# Altium schematic sheet CY8C4125AZI-S433.SchDoc: CY8C4125AZI-S433
size A3; SheetNumber: 2; SheetTotal: 3
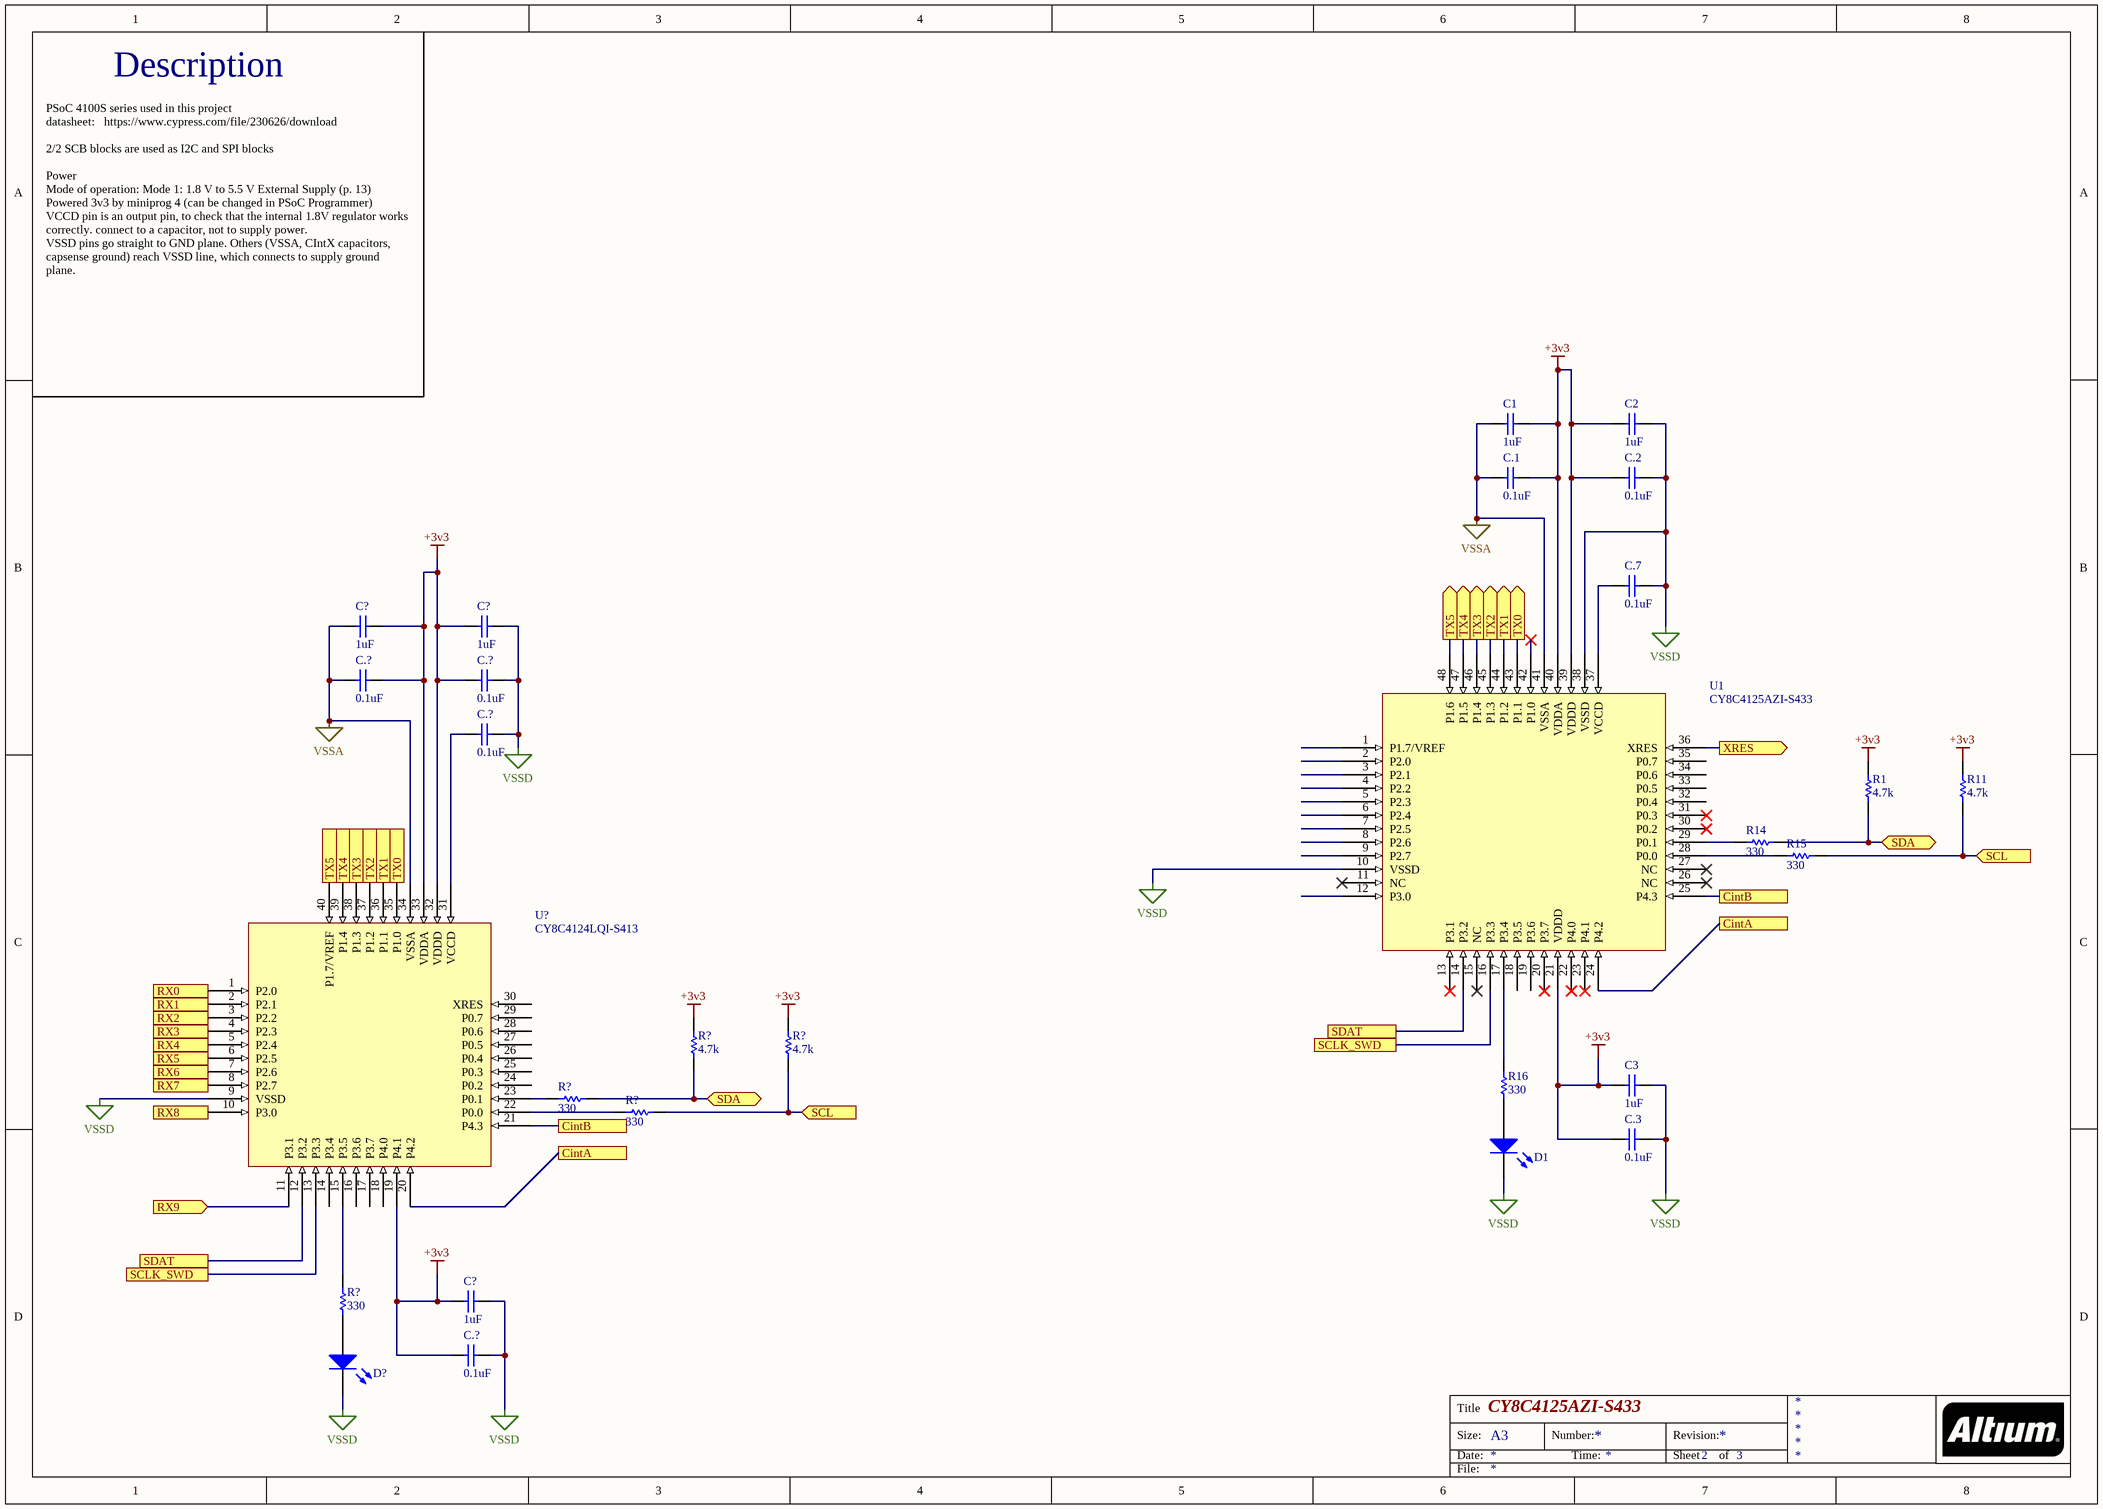
[diagram p0: CY8C4125AZI-S433.SchDoc]

## Parts
(Parts that share a designator on the sheet are numbered #1, #2 ... from top to bottom, then left to right.)
C1  1uF  [CAPC1005X56X25ML10T15]
C2  1uF  [CAPC1005X56X25ML10T15]
C3  1uF  [CAPC1005X56X25ML10T15]
C.1  0.1uF  [CAPC1005X56X25ML10T15]
C.2  0.1uF  [CAPC1005X56X25ML10T15]
C.3  0.1uF  [CAPC1005X56X25ML10T15]
C.7  0.1uF  [CAPC1005X56X25ML10T15]
C.?#1  0.1uF  [CAPC1005X56X25ML10T15]
C.?#2  0.1uF  [CAPC1005X56X25ML10T15]
C.?#3  0.1uF  [CAPC1005X56X25ML10T15]
C.?#4  0.1uF  [CAPC1005X56X25ML10T15]
C?#1  1uF  [CAPC1005X56X25ML10T15]
C?#2  1uF  [CAPC1005X56X25ML10T15]
C?#3  1uF  [CAPC1005X56X25ML10T15]
D1  150060BS75000  [0603_A]  (value not drawn)
D?  150060BS75000  [0603_A]  (value not drawn)
R1  4.7k  [RESC1005X40X25ML05T10]
R11  4.7k  [RESC1005X40X25ML05T10]
R14  330  [RESC1005X40X25ML05T10]
R15  330  [RESC1005X40X25ML05T10]
R16  330  [RESC1005X40X25ML05T10]
R?#1  4.7k  [RESC1005X40X25ML05T10]
R?#2  4.7k  [RESC1005X40X25ML05T10]
R?#3  330  [RESC1005X40X25ML05T10]
R?#4  330  [RESC1005X40X25ML05T10]
R?#5  330  [RESC1005X40X25ML05T10]
U1  CY8C4125AZI-S433  [CY8C4125AZI-S433]
U?  CY8C4124LQI-S413  [CY8C4125LQS-S423]

## Ports
CintA, CintB, RX0 (in), RX1 (in), RX2 (in), RX3 (in), RX4 (in), RX5 (in), RX6 (in), RX7 (in), RX8 (in), RX9 (in), SCL (in), SCLK_SWD, SDA (bidir), SDAT, TX0 (out), TX1 (out), TX2 (out), TX3 (out), TX4 (out), TX5 (out), XRES (out)

## Nets
+3v3: C1.2 C2.1 C3.1 C.1.2 C.2.1 C.3.1 C.?#1.2 C.?#2.1 C.?#4.1 C?#1.2 C?#2.1 C?#3.1 R1.2 R11.2 R?#1.2 R?#2.2 U1.21(VDDD) U1.39(VDDD) U1.40(VDDA) U?.19(P4.1) U?.32(VDDD) U?.33(VDDA)
VSSA: C1.1 C.1.1 C.?#1.1 C?#1.1 U1.41(VSSA) U?.34(VSSA)
VSSD: C2.2 C3.2 C.2.2 C.3.2 C.7.2 C.?#2.2 C.?#3.2 C.?#4.2 C?#2.2 C?#3.2 D1.1(K) D?.1(K) U1.10(VSSD) U1.38(VSSD) U?.9(VSSD)
CintA: U1.24(P4.2) U?.20(P4.2) ; port CintA
CintB: U1.25(P4.3) U?.21(P4.3) ; port CintB
RX0: U?.1(P2.0) ; port RX0
RX1: U?.2(P2.1) ; port RX1
RX2: U?.3(P2.2) ; port RX2
RX3: U?.4(P2.3) ; port RX3
RX4: U?.5(P2.4) ; port RX4
RX5: U?.6(P2.5) ; port RX5
RX6: U?.7(P2.6) ; port RX6
RX7: U?.8(P2.7) ; port RX7
RX8: U?.10(P3.0) ; port RX8
RX9: U?.11(P3.1) ; port RX9
SCL: R11.1 R15.2 R?#2.1 R?#4.2 ; port SCL
SCLK_SWD: U1.16(P3.3) U?.13(P3.3) ; port SCLK_SWD
SDA: R1.1 R14.2 R?#1.1 R?#3.2 ; port SDA
SDAT: U1.14(P3.2) U?.12(P3.2) ; port SDAT
TX0: U1.43(P1.1) U?.35(P1.0) ; port TX0
TX1: U1.44(P1.2) U?.36(P1.1) ; port TX1
TX2: U1.45(P1.3) U?.37(P1.2) ; port TX2
TX3: U1.46(P1.4) U?.38(P1.3) ; port TX3
TX4: U1.47(P1.5) U?.39(P1.4) ; port TX4
TX5: U1.48(P1.6) U?.40(P1.7/VREF) ; port TX5
XRES: U1.36(XRES) ; port XRES
NetC.7_1: C.7.1 U1.37(VCCD)
NetC.?#3_1: C.?#3.1 U?.31(VCCD)
NetD1_2: D1.2(A) R16.2
NetD?_2: D?.2(A) R?#5.2
NetR14_1: R14.1 U1.29(P0.1)
NetR15_1: R15.1 U1.28(P0.0)
NetR16_1: R16.1 U1.17(P3.4)
NetR?#3_1: R?#3.1 U?.23(P0.1)
NetR?#4_1: R?#4.1 U?.22(P0.0)
NetR?#5_1: R?#5.1 U?.15(P3.5)

Not connected (* = marked no-connect by the designer): U1 1(P1.7/VREF) 2(P2.0) 3(P2.1) 4(P2.2) 5(P2.3) 6(P2.4) 7(P2.5) 8(P2.6) 9(P2.7) 11(NC)* 12(P3.0) 13(P3.1)* 15(NC)* 18(P3.5) 19(P3.6) 20(P3.7)* 22(P4.0)* 23(P4.1)* 26(NC)* 27(NC)* 30(P0.2)* 31(P0.3)* 32(P0.4) 33(P0.5) 34(P0.6) 35(P0.7) 42(P1.0)*; U? 14(P3.4) 16(P3.6) 17(P3.7) 18(P4.0) 24(P0.2) 25(P0.3) 26(P0.4) 27(P0.5) 28(P0.6) 29(P0.7) 30(XRES)

## Notes on the sheet
- Description
- PSoC 4100S series used in this project
  datasheet:   https://www.cypress.com/file/230626/download
  2/2 SCB blocks are used as I2C and SPI blocks
  Power
  Mode of operation: Mode 1: 1.8 V to 5.5 V External Supply (p. 13)
  Powered 3v3 by miniprog 4 (can be changed in PSoC Programmer)
  VCCD pin is an output pin, to check that the internal 1.8V regulator works correctly. connect to a capacitor, not to supply power.
  VSSD pins go straight to GND plane. Others (VSSA, CIntX capacitors, capsense ground) reach VSSD line, which connects to supply ground plane.
- Title
- Size:
- Date:
- A3
- Number:
- Time:
- Revision:
- Sheet
- of
- File:

## Library data of the parts
C1-C3 C.1-C.3 C.7 C.?#1-C.?#4 C?#1-C?#3 = CMP-1034-02113-2: Manufacturer: AVX Interconnect / Elco; Part Number: 04026D105KAT2A
D1 D? = CMP-1426-00003-1: SMD mono-color Chip LED, WL-SMCW, Blue; Manufacturer: Wuerth Elektronik; Color: Blue; ComponentLink2Description: Datasheet; ComponentLink2URL: http://katalog.we-online.com/led/datasheet/150060BS75000.pdf; ComponentLink1URL: http://www.we-online.com; PackageReference: 0603_A; PartNumber: 150060BS75000; ComponentLink1Description: Manufacturer URL
R1 R11 R14-R16 R?#1-R?#5 = CMP-2002-07972-1: Part Number: RC0402JR-072KL; Manufacturer: Yageo / Phycomp